# Altium project EInk.PrjPcb
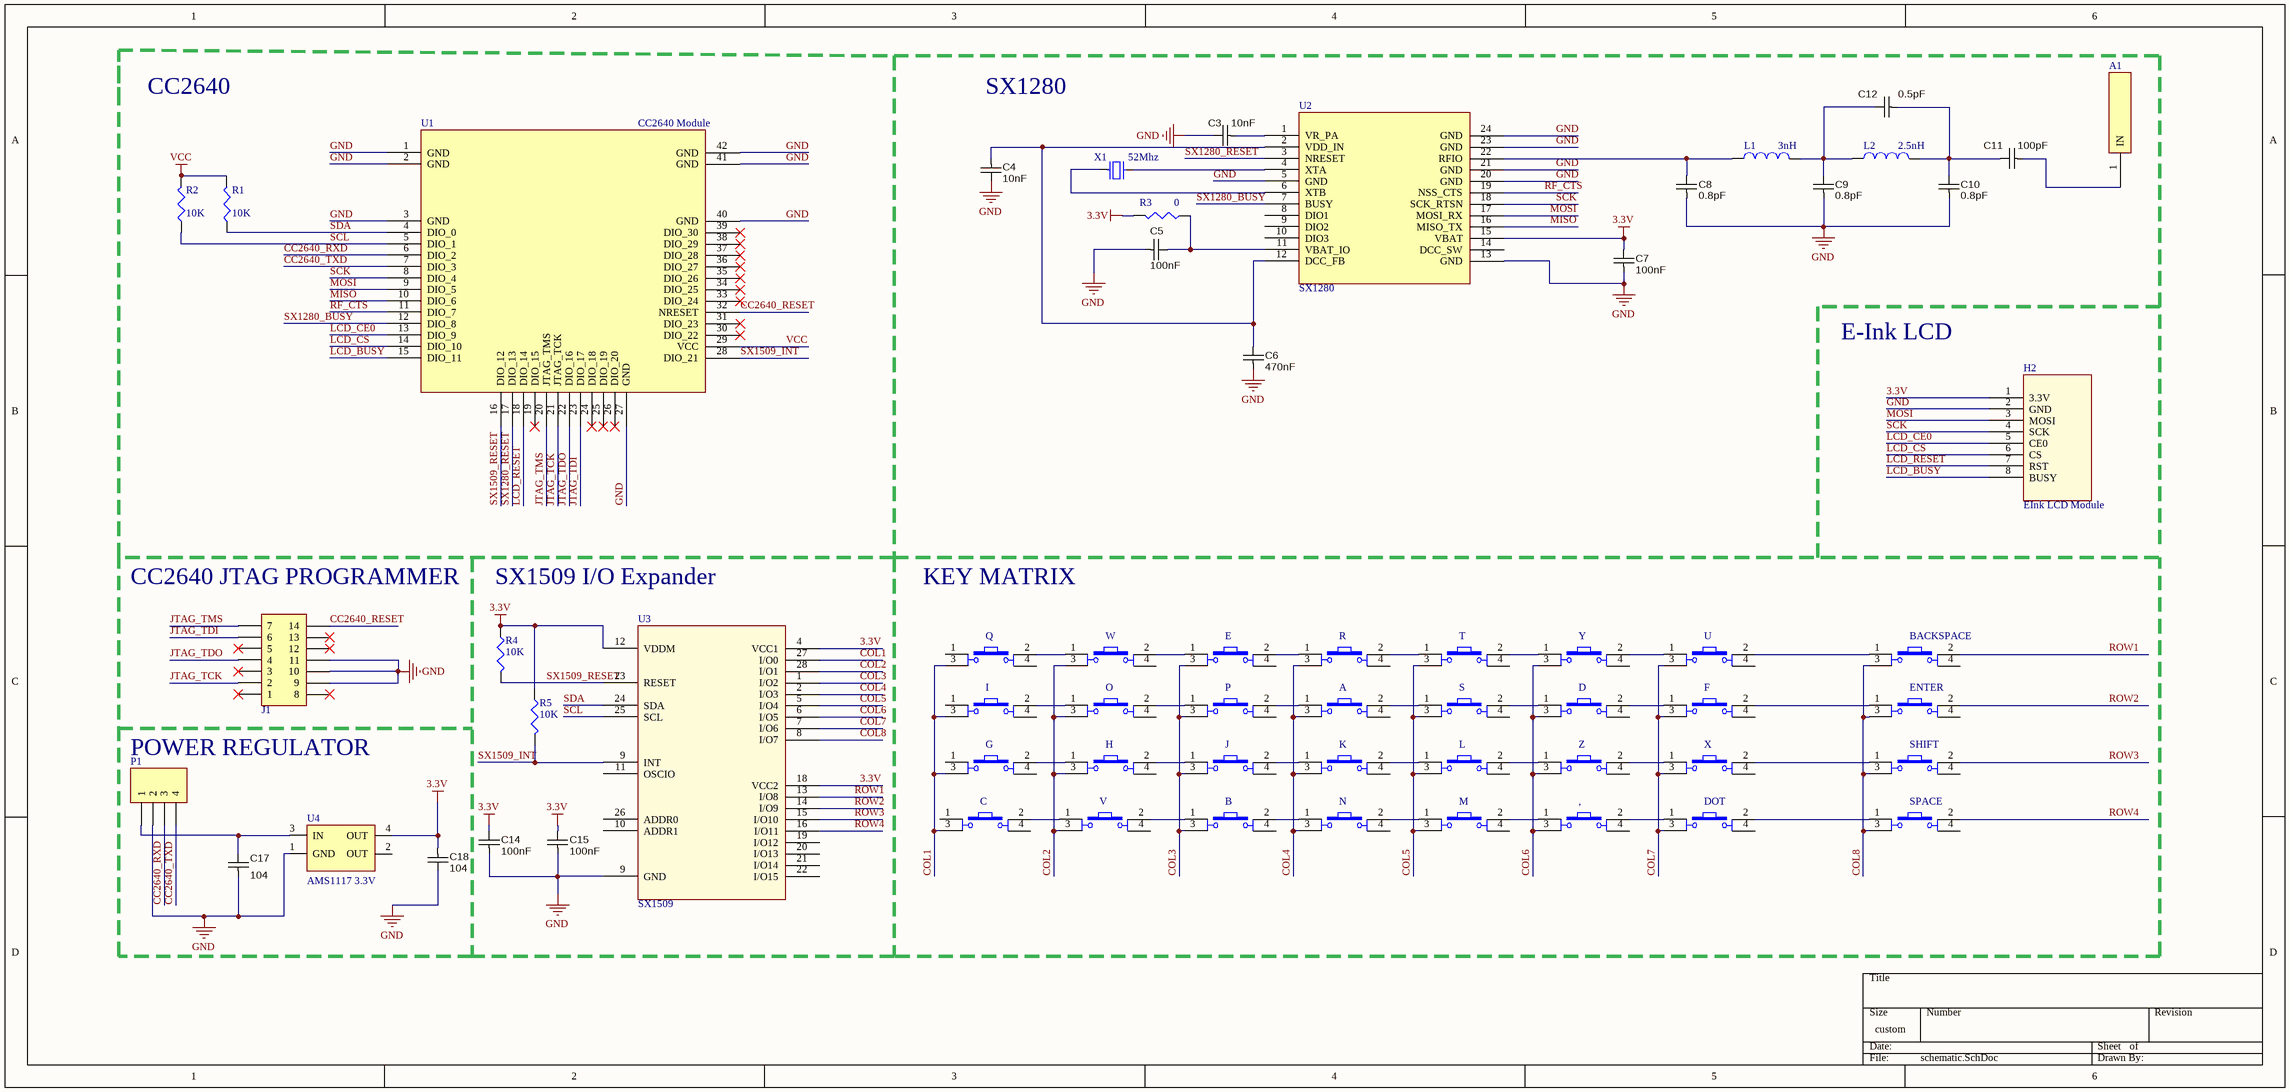
[diagram p0: schematic.SchDoc]
1 sheet, 62 parts. Net scope: global (net labels, ports and power ports of the same name join across sheets).
Board file: PCB.PcbDoc

## Sheet schematic.SchDoc
size 508 x 241 mm

### Parts
,  SW  [Kha_Button]  (value not drawn)
A  SW  [Kha_Button]  (value not drawn)
A1  Antenna  [Antenna]  (value not drawn)
B  SW  [Kha_Button]  (value not drawn)
BACKSPACE  SW  [Kha_Button]  (value not drawn)
C  SW  [Kha_Button]  (value not drawn)
C3  value 10nF  [SMD-0603c]  (hidden comment: approved sub OK)
C4  value 10nF  [SMD-0603c]  (hidden comment: approved sub OK)
C5  value 100nF  [SMD-0603c]  (hidden comment: approved sub OK)
C6  value 470nF  [SMD-0603c]  (hidden comment: approved sub OK)
C7  value 100nF  [SMD-0603c]  (hidden comment: approved sub OK)
C8  value 0.8pF  [SMD-0603c]  (hidden comment: approved sub OK)
C9  value 0.8pF  [SMD-0603c]  (hidden comment: approved sub OK)
C10  value 0.8pF  [SMD-0603c]  (hidden comment: approved sub OK)
C11  value 100pF  [SMD-0603c]  (hidden comment: approved sub OK)
C12  value 0.5pF  [SMD-0603c]  (hidden comment: approved sub OK)
C14  value 100nF  [SMD-0603c]  (hidden comment: approved sub OK)
C15  value 100nF  [SMD-0603c]  (hidden comment: approved sub OK)
C17  value 104  [SMD-0603c]  (hidden comment: approved sub OK)
C18  value 104  [SMD-0603c]  (hidden comment: approved sub OK)
D  SW  [Kha_Button]  (value not drawn)
DOT  SW  [Kha_Button]  (value not drawn)
E  SW  [Kha_Button]  (value not drawn)
ENTER  SW  [Kha_Button]  (value not drawn)
F  SW  [Kha_Button]  (value not drawn)
G  SW  [Kha_Button]  (value not drawn)
H  SW  [Kha_Button]  (value not drawn)
H2  EInk LCD Module  [EInk_Module]
I  SW  [Kha_Button]  (value not drawn)
J  SW  [Kha_Button]  (value not drawn)
J1  14p  [610114249121]  (value not drawn)
K  SW  [Kha_Button]  (value not drawn)
L  SW  [Kha_Button]  (value not drawn)
L1  value 3nH  [0603]  (hidden comment: Inductor)
L2  value 2.5nH  [0603]  (hidden comment: Inductor)
M  SW  [Kha_Button]  (value not drawn)
N  SW  [Kha_Button]  (value not drawn)
O  SW  [Kha_Button]  (value not drawn)
P  SW  [Kha_Button]  (value not drawn)
P1  Header 4  [Header 4 SMT]  (value not drawn)
Q  SW  [Kha_Button]  (value not drawn)
R  SW  [Kha_Button]  (value not drawn)
R1  value 10K  [J1-0603]  (hidden comment: Res3)
R2  value 10K  [J1-0603]  (hidden comment: Res3)
R3  value 0  [J1-0603]  (hidden comment: Res3)
R4  value 10K  [J1-0603]  (hidden comment: Res3)
R5  value 10K  [J1-0603]  (hidden comment: Res3)
S  SW  [Kha_Button]  (value not drawn)
SHIFT  SW  [Kha_Button]  (value not drawn)
SPACE  SW  [Kha_Button]  (value not drawn)
T  SW  [Kha_Button]  (value not drawn)
U  SW  [Kha_Button]  (value not drawn)
U1  CC2640 Module  [CC2640 Module]
U2  SX1280  [SX1280_QFN24 4x4]
U3  SX1509  [QFN28UT]
U4  AMS1117 3.3V  [AMS1117]
V  SW  [Kha_Button]  (value not drawn)
W  SW  [Kha_Button]  (value not drawn)
X  SW  [Kha_Button]  (value not drawn)
X1  52Mhz  [OSCSC500X320X110-4N]
Y  SW  [Kha_Button]  (value not drawn)
Z  SW  [Kha_Button]  (value not drawn)

### Nets
3.3V: C7.2 C14.2 C15.2 C18.1 H2.1(3.3V) R3.2 R4.1 R5.1 U2.15(VBAT) U3.4(VCC1) U3.12(VDDM) U3.18(VCC2) U4.4(OUT)
GND: C3.2 C4.2 C5.1 C6.1 C7.1 C8.1 C9.1 C10.1 C14.1 C15.1 C17.1 C18.2 H2.2(GND) J1.9 J1.10 J1.11 P1.2 U1.1(GND) U1.2(GND) U1.3(GND) U1.27(GND) U1.40(GND) U1.41(GND) U1.42(GND) U2.5(GND) U2.13(GND) U2.20(GND) U2.21(GND) U2.23(GND) U2.24(GND) U3.9(GND) U4.1(GND)
VCC: R1.2 R2.2 U1.29(VCC)
CC2640_RESET: J1.14 U1.32(NRESET)
CC2640_RXD: P1.3 U1.6(DIO_2)
CC2640_TXD: P1.4 U1.7(DIO_3)
COL1: C.3 G.3 I.3 Q.3 U3.27(I/O0)
COL2: H.3 O.3 U3.28(I/O1) V.3 W.3
COL3: B.3 E.3 J.3 P.3 U3.1(I/O2)
COL4: A.3 K.3 N.3 R.3 U3.2(I/O3)
COL5: L.3 M.3 S.3 T.3 U3.5(I/O4)
COL6: ,.3 D.3 U3.6(I/O5) Y.3 Z.3
COL7: DOT.3 F.3 U.3 U3.7(I/O6) X.3
COL8: BACKSPACE.3 ENTER.3 SHIFT.3 SPACE.3 U3.8(I/O7)
JTAG_TCK: J1.2 U1.21(JTAG_TCK)
JTAG_TDI: J1.6 U1.23(DIO_17)
JTAG_TDO: J1.4 U1.22(DIO_16)
JTAG_TMS: J1.7 U1.20(JTAG_TMS)
LCD_BUSY: H2.8(BUSY) U1.15(DIO_11)
LCD_CE0: H2.5(CE0) U1.13(DIO_9)
LCD_CS: H2.6(CS) U1.14(DIO_10)
LCD_RESET: H2.7(RST) U1.18(DIO_14)
MISO: U1.10(DIO_6) U2.16(MISO_TX)
MOSI: H2.3(MOSI) U1.9(DIO_5) U2.17(MOSI_RX)
RF_CTS: U1.11(DIO_7) U2.19(NSS_CTS)
ROW1: BACKSPACE.2 U3.13(I/O8)
ROW2: ENTER.2 U3.14(I/O9)
ROW3: SHIFT.2 U3.15(I/O10)
ROW4: SPACE.2 U3.16(I/O11)
SCK: H2.4(SCK) U1.8(DIO_4) U2.18(SCK_RTSN)
SCL: R2.1 U1.5(DIO_1) U3.25(SCL)
SDA: R1.1 U1.4(DIO_0) U3.24(SDA)
SX1280_BUSY: U1.12(DIO_8) U2.7(BUSY)
SX1280_RESET: U1.17(DIO_13) U2.3(NRESET)
SX1509_INT: R5.2 U1.28(DIO_21) U3.9(INT)
SX1509_RESET: R4.2 U1.16(DIO_12) U3.23(RESET)
Net,_1: ,.1 M.2
Net,_2: ,.2 DOT.1
NetA1_1: A1.1(IN) C11.1
NetA_1: A.1 P.2
NetA_2: A.2 S.1
NetB_1: B.1 V.2
NetB_2: B.2 N.1
NetBACKSPACE_1: BACKSPACE.1 U.2
NetC3_1: C3.1 U2.1(VR_PA)
NetC4_1: C4.1 C6.2 U2.2(VDD_IN) U2.12(DCC_FB)
NetC5_2: C5.2 R3.1 U2.11(VBAT_IO)
NetC8_2: C8.2 L1.1 U2.22(RFIO)
NetC9_2: C9.2 C12.2 L1.2 L2.1
NetC10_2: C10.2 C11.2 C12.1 L2.2
NetC17_2: C17.2 P1.1 U4.3(IN)
NetC_2: C.2 V.1
NetD_1: D.1 S.2
NetD_2: D.2 F.1
NetDOT_2: DOT.2 SPACE.1
NetE_1: E.1 W.2
NetE_2: E.2 R.1
NetENTER_1: ENTER.1 F.2
NetG_2: G.2 H.1
NetH_2: H.2 J.1
NetI_2: I.2 O.1
NetJ_2: J.2 K.1
NetK_2: K.2 L.1
NetL_2: L.2 Z.1
NetM_1: M.1 N.2
NetO_2: O.2 P.1
NetQ_2: Q.2 W.1
NetR_2: R.2 T.1
NetSHIFT_1: SHIFT.1 X.2
NetT_2: T.2 Y.1
NetU2_4: U2.4(XTA) X1.3
NetU2_6: U2.6(XTB) X1.1
NetU_1: U.1 Y.2
NetX_1: X.1 Z.2

Not connected (* = marked no-connect by the designer): , 4; A 4; B 4; BACKSPACE 4; C 1 4; D 4; DOT 4; E 4; ENTER 4; F 4; G 1 4; H 4; I 1 4; J 4; J1 1* 3* 5* 8* 12* 13*; K 4; L 4; M 4; N 4; O 4; P 4; Q 1 4; R 4; S 4; SHIFT 4; SPACE 4; T 4; U 4; U1 19(DIO_15)* 24(DIO_18)* 25(DIO_19)* 26(DIO_20)* 30(DIO_22)* 31(DIO_23)* 33(DIO_24)* 34(DIO_25)* 35(DIO_26)* 36(DIO_27)* 37(DIO_28)* 38(DIO_29)* 39(DIO_30)*; U2 8(DIO1) 9(DIO2) 10(DIO3) 14(DCC_SW); U3 10(ADDR1) 11(OSCIO) 19(I/O12) 20(I/O13) 21(I/O14) 22(I/O15) 26(ADDR0); U4 2(OUT); V 4; W 4; X 4; Y 4; Z 4

### Notes on the sheet
- CC2640
- SX1280
- E-Ink LCD
- (near J1) CC2640 JTAG PROGRAMMER
- SX1509 I/O Expander
- KEY MATRIX
- POWER REGULATOR

### Library data of the parts
, A B BACKSPACE C D DOT E ENTER F G H I J K L M N O P Q R S SHIFT SPACE T U V W X Y Z = SW4: Switch button 4 pin; Value: Button chip 4 pin
C3-C12 C14 C15 C17 C18 = CAPC_1n_0603_X7R_100V_10%: Capacitor SMD Cer 1nF 10% 100V X7R 0603; Manufacturer 1: Murata Electronics North America; Manufacturer Part Number 1: GCM188R72A102KA37D; Ratings: 100V; X7R; Material: ceramic; SCDType: spec; Package / Case: 0603 (1608 metric); Tolerance: ±10%; Supplier 1: Digi-Key; Supplier Part Number 1: 490-4780-1-ND; Operating Temperature: -55°C ~ 125°C; Size / Dimension: 0.063" L x 0.031" W (1.60mm x 0.80mm); Thickness (Max): 0.035" (0.90mm); ComponentLink1URL: http://search.murata.co.jp/Ceramy/image/img/PDF/ENG/GCM188R72A102KA37.pdf; ComponentLink1Description: http://search.murata.co.jp/Ceramy/image/img/PDF/ENG/GCM188R72A102KA37.pdf
H2 = E-Ink LCD
J1 = 610114249121: WR-PHD 2.54 mm Pin Header - SMT Type Double Row Right Angled, 14p; PublishedDate: July 2016; Publisher: Wurth Elektronik; ComponentLink1Description: Manufacturer; ComponentLink1URL: http://www.we-online.de; ComponentLink2Description: Datasheet; ComponentLink2URL: http://katalog.we-online.de/em/datasheet/6101xx249121.pdf; PartNumber: 610114249121; PinNumber: 14p
L1 L2 = Inductor: Code_IEC: 1005; Published: 8-Jun-2000; LatestRevisionDate: 29-May-2009; LatestRevisionNote: IPC-7351 Footprint Added.; PackageReference: 0402-A; Publisher: Altium Limited; PackageDescription: Chip Inductor; Code_JEITA: 0402
P1 = Header 4: Header, 4-Pin; LatestRevisionDate: 17-Jul-2002; LatestRevisionNote: Re-released for DXP Platform.; Publisher: Altium Limited
R1-R5 = Res3: Resistor; Published: 8-Jun-2000; LatestRevisionDate: 29-May-2009; LatestRevisionNote: IPC-7351 Footprint Added.; PackageReference: J1-0603; Publisher: Altium Limited; PackageDescription: Chip Resistor
U4 = AMS1117
X1 = XT2: Crystal For all Crystal 2pin.; Value: 4Mhz